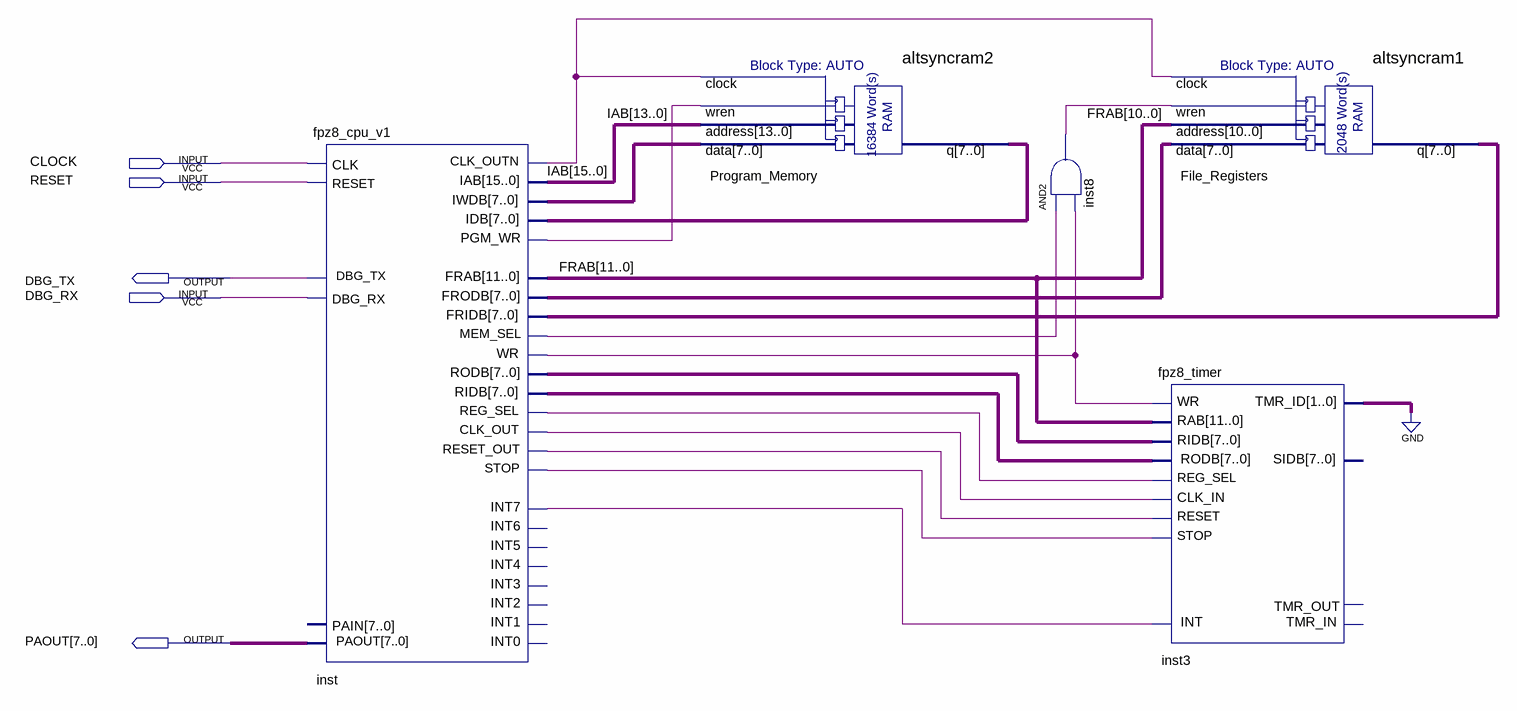
[diagram p0: schematic sheet]
// Quartus schematic CPU.bdf as structural Verilog: 5 symbols, 5 pins
module CPU (
  input  CLOCK,
  input  RESET,
  input  DBG_RX,
  output DBG_TX,
  output [7:0] PAOUT
);

  wire inst3_int, inst8_out, inst_clk_out, inst_clk_outn, inst_mem_sel, inst_pgm_wr, inst_reg_sel,
       inst_reset_out, inst_stop, inst_wr;
  wire [7:0] File_Registers_q, inst3_rodb, inst_frodb, inst_iwdb, inst_rodb, Program_Memory_q;
  wire [11:0] FRAB;
  wire [15:0] IAB;

  fpz8_cpu_v1 inst (
    .IDB(Program_Memory_q), .FRIDB(File_Registers_q), .RIDB(inst3_rodb), .INT7(inst3_int), .DBG_RX(DBG_RX),
    .CLK(CLOCK), .RESET(RESET), .IAB(IAB), .IWDB(inst_iwdb), .FRAB(FRAB), .FRODB(inst_frodb),
    .RODB(inst_rodb), .PGM_WR(inst_pgm_wr), .WR(inst_wr), .REG_SEL(inst_reg_sel), .MEM_SEL(inst_mem_sel),
    .DBG_TX(DBG_TX), .PAOUT(PAOUT), .CLK_OUT(inst_clk_out), .CLK_OUTN(inst_clk_outn), .STOP(inst_stop),
    .RESET_OUT(inst_reset_out));  // open: INT0, INT1, INT2, INT3, INT4, INT5, INT6, PAIN
  altsyncram2 Program_Memory (
    .data(inst_iwdb), .address(IAB[13:0]), .wren(inst_pgm_wr), .clock(inst_clk_outn), .q(Program_Memory_q));
  and inst8 (inst8_out, inst_mem_sel, inst_wr);
  altsyncram1 File_Registers (
    .data(inst_frodb), .address(FRAB[10:0]), .wren(inst8_out), .clock(inst_clk_outn), .q(File_Registers_q));
  fpz8_timer inst3 (
    .RAB(FRAB), .RIDB(inst_rodb), .REG_SEL(inst_reg_sel), .WR(inst_wr), .CLK_IN(inst_clk_out),
    .STOP(inst_stop), .TMR_ID(2'b00), .RESET(inst_reset_out), .RODB(inst3_rodb), .INT(inst3_int));  // open: SIDB, TMR_IN, TMR_OUT
endmodule
